# EAGLE design DCshieldV0.42 (EAGLE 6.5.0)
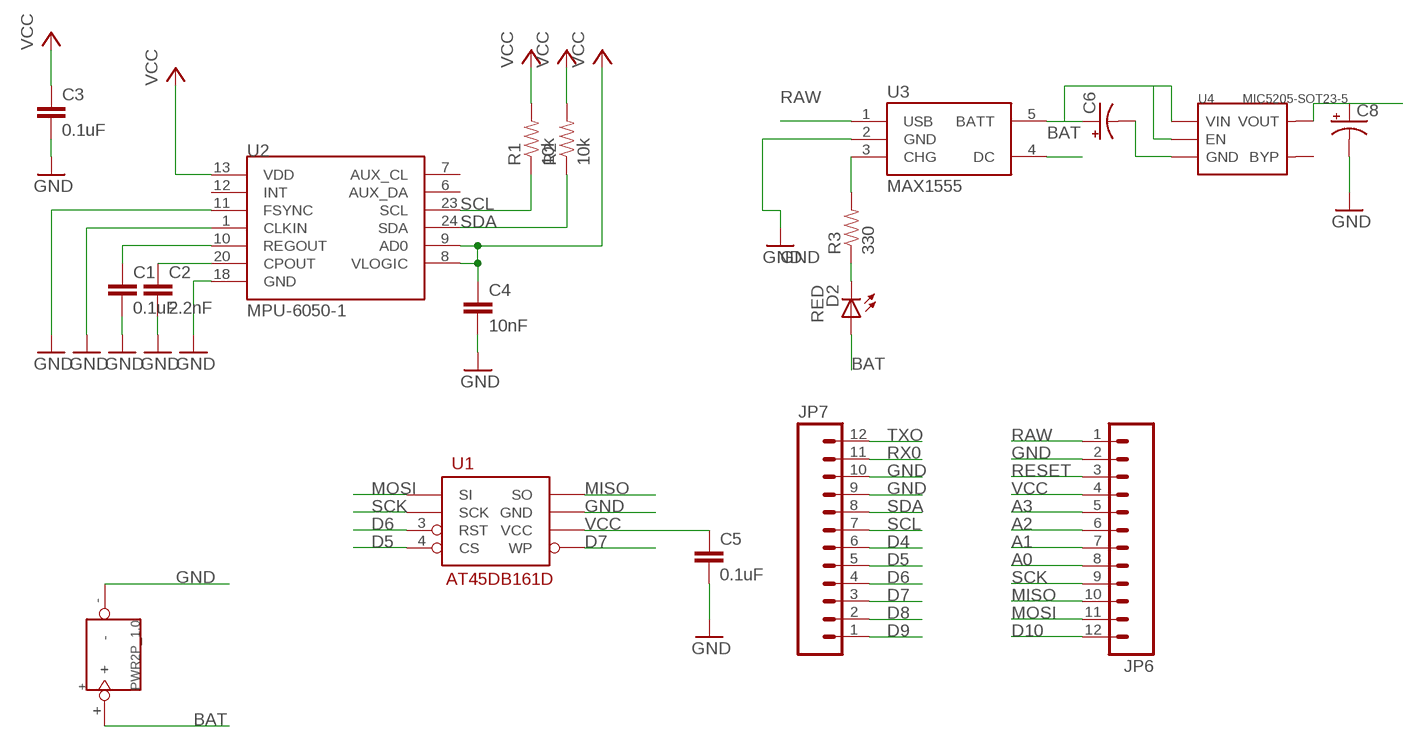
[diagram p0: schematic, sheet 1]

## Parts
+  PWR2P_1.0  [PWR2P_1.0]
C1  0.1uF  CAP0402-CAP  [0402-CAP]
C2  2.2nF  CAP0402-CAP  [0402-CAP]
C3  0.1uF  CAP0402-CAP  [0402-CAP]
C4  10nF  CAP0402-CAP  [0402-CAP]
C5  0.1uF  CAP0402-CAP  [0402-CAP]
C6  CAP_POL1206  [EIA3216]
C8  CAP_POL1206  [EIA3216]
D2  RED  LED-RED0603  [LED-0603]
JP6  M12PTH  [1X12]
JP7  M12PTH  [1X12]
R1  10k  RESISTOR0402-RES  [0402-RES]
R2  10k  RESISTOR0402-RES  [0402-RES]
R3  330  RESISTOR0402-RES  [0402-RES]
U1  AT45DB161D  [SO08-EIAJ]
U2  MPU-6050-1  [QFN-24-4MM2]
U3  MAX1555  [SOT23-5]
U4  MIC5205-SOT23-5  [SOT23-5]

## Nets
A0: JP6.8
A1: JP6.7
A2: JP6.6
A3: JP6.5
BAT [vcc]: +.+ C6.A(+) D2.A U3.5(BATT) U4.1(VIN) U4.3(EN)
D4: JP7.6
D5: JP7.5 U1.4(CS)
D6: JP7.4 U1.3(RST)
D7: JP7.3 U1.5(WP)
D8: JP7.2
D9: JP7.1
D10: JP6.12
GND: +.- C1.2 C2.2 C3.2 C4.2 C5.2 C6.C(-) C8.C(-) JP6.2 JP7.9 JP7.10 U1.7(GND) U2.1(CLKIN) U2.11(FSYNC) U2.18(GND) U3.2(GND) U4.2(GND)
MISO: JP6.10 U1.8(SO)
MOSI: JP6.11 U1.1(SI)
N$15: C1.1 U2.10(REGOUT)
N$16: C2.1 U2.20(CPOUT)
N$18: R3.2 U3.3(CHG)
N$19: D2.C R3.1
RAW [vcc]: JP6.1 U3.1(USB) U3.4(DC)
RESET: JP6.3
RX0: JP7.11
SCK: JP6.9 U1.2(SCK)
SCL: JP7.7 R1.1 U2.23(SCL)
SDA: JP7.8 R2.1 U2.24(SDA)
TXO: JP7.12
VCC: C3.1 C4.1 C5.1 C8.A(+) JP6.4 R1.2 R2.2 U1.6(VCC) U2.8(VLOGIC) U2.9(AD0) U2.13(VDD) U4.5(VOUT)
Unconnected: U2.6(AUX_DA) U2.7(AUX_CL) U2.12(INT) U4.4(BYP)

## Library data of the parts
+ = Seeeduino_Film_v0.9b:PWR2P
C1-C5 = SparkFun-Capacitors:CAP: Capacitor Standard 0603 ceramic capacitor, and 0.1" leaded capacitor.
C6 C8 = SparkFun-Capacitors:CAP_POL: Capacitor Polarized These are standard SMD and PTH capacitors. Normally 10uF, 47uF, and 100uF in electrolytic and tantalum varieties. Always verify the external diameter of the through hole cap, it varies with capacity, voltage, and manufacturer. The EIA devices should be standard.
D2 = SparkFun-LED:LED-RED: Assorted Red LEDs LilyPad 1206- DIO-09912 1206- DIO-00809 0603- DIO-00819; PROD_ID: DIO-00819
JP6 JP7 = SparkFun:M12: Header 12 Standard 12-pin 0.1" header. Use with straight break away headers (SKU : PRT-00116), right angle break away headers (PRT-00553), swiss pins (PRT-00743), machine pins (PRT-00117), and female headers (PRT-00115).
R1-R3 = SparkFun-Resistors:RESISTOR: Resistor Basic schematic elements and footprints for 0603, 1206, and PTH resistors.
U1 = SparkFun-DigitalIC:AT45DB161D: 16-Mbit SPI flash memory
U2 = MPU-6050_Breakout_V11:MPU-6050
U3 = LiPo-USB-Charger-v13:MAX1555: MAX1555 Lithium Charger IC SOT-23 Lithium Polymer charging IC. Schematic element and footprint proven. Spark Fun Electronics SKU : COM-00674
U4 = IC:MIC5205: The MIC5205 is an efficient linear voltage regulator with ultra-low-noise output, very low dropout voltage (typically 17mV at light loads and 165mV at 150mA), and very low ground current (600µA at 100mA output). The MIC5205 offers better than 1% initial accuracy. datasheet here: http://www.micrel.com/product-info/prod/5205.shtml

## Net classes
0 default: width 0.203 mm

## Board
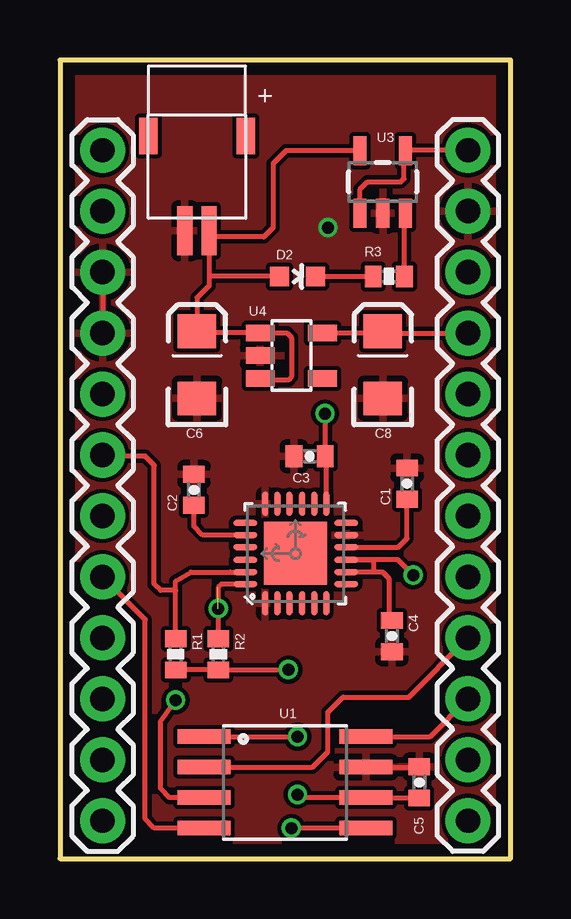
[diagram p1: board, top side]
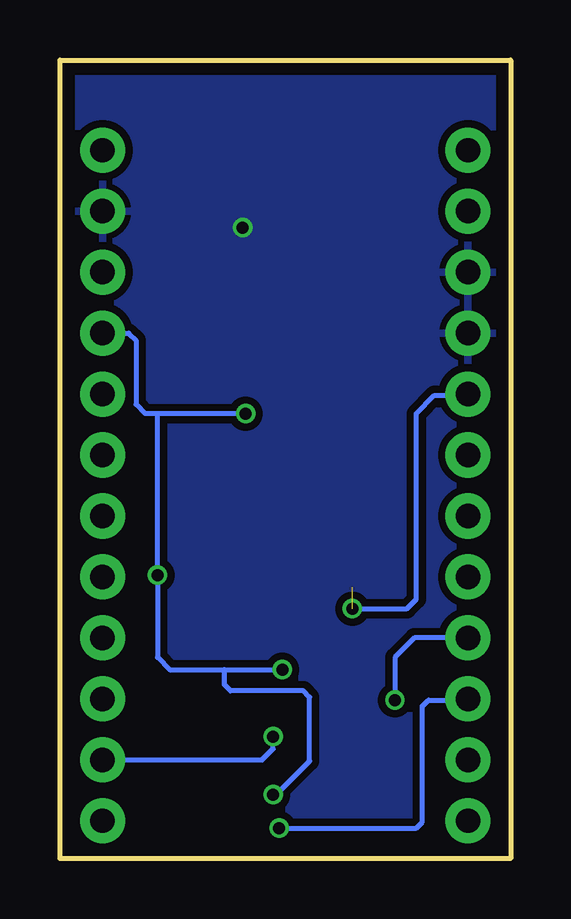
[diagram p2: board, bottom side, seen from below]

Size 18.8 x 33.27 mm. Coordinates in mm from the lower left corner, seen from the top.
Outline: 0,33.27 0,0 18.8,0 18.8,33.27 0,33.27
Copper layers (1*16): Top 0.035mm / dielectric 1.5mm / Bottom 0.035mm
Design rules "EagleRules": minimum track width 7mil, minimum drill 12mil, track to track 7mil, track to pad 7mil, pad to pad 7mil, via to via 7mil, smd to smd 0mil, copper to edge 20mil, drill to drill 10mil, minimum pad ring 10mil, minimum via ring 6mil, stop-mask expansion 2mil, vias tented up to drill 25mil, thermal gap 10mil

### Footprints (pad centres in the part's own frame; a part is rotated, then mirrored left to right if it is on the bottom)
PWR2P_1.0 = smd 2.032 x 0.635: + 0.508,0.508; - 0.508,-0.508 | smd 1.524 x 0.762: P$3 -3.429,2.032; P$4 -3.429,-2.032
0402-CAP = smd 0.7 x 0.9: 1 -0.65,0; 2 0.65,0
EIA3216 = smd 1.4 x 1.6: A 1.4,0; C -1.4,0
LED-0603 = smd 0.8 x 0.8: A 0,-0.75; C 0,0.75
1X12 = drill 1.016 pad 1.88: 1 0,0; 2 2.54,0; 3 5.08,0; 4 7.62,0; 5 10.16,0; 6 12.7,0; 7 15.24,0; 8 17.78,0; 9 20.32,0; 10 22.86,0; 11 25.4,0; 12 27.94,0
0402-RES = smd 0.7 x 0.9: 1 -0.65,0; 2 0.65,0
SO08-EIAJ = smd 0.61 x 2.21: 1 -1.905,-3.378; 2 -0.635,-3.378; 3 0.635,-3.378; 4 1.905,-3.378; 5 1.905,3.353; 6 0.635,3.353; 7 -0.635,3.353; 8 -1.905,3.353
QFN-24-4MM2 = smd 1.016 x 0.254: 1 -2.066,1.257; 2 -2.066,0.75; 3 -2.066,0.247; 4 -2.066,-0.287; 5 -2.066,-0.792; 6 -2.066,-1.297; 13 2.086,-1.297; 14 2.086,-0.792; 15 2.086,-0.287; 16 2.086,0.247; 17 2.086,0.75; 18 2.086,1.257 | smd 0.254 x 1.016: 7 -1.267,-2.122; 8 -0.762,-2.122; 9 -0.258,-2.122; 10 0.278,-2.122; 11 0.78,-2.122; 12 1.287,-2.122; 19 1.287,2.082; 20 0.78,2.082; 21 0.278,2.082; 22 -0.258,2.082; 23 -0.762,2.082; 24 -1.267,2.082 | smd 2.616 x 2.616: P$1 0.02,-0.01
SOT23-5 = smd 0.55 x 1.2: 1 -0.95,-1.3; 2 0,-1.3; 3 0.95,-1.3; 4 0.95,1.3; 5 -0.95,1.3
SOT23-5' = smd 0.69 x 1.2: 1 -0.95,-1.3; 2 0,-1.3; 3 0.95,-1.3; 4 0.95,1.3; 5 -0.95,1.3

### Placement (x,y rotation side)
+  5.71,26.67 270 top
C1  14.48,15.62 90 top
C2  5.59,15.37 90 top
C3  10.41,16.76 180 top
C4  13.84,9.27 270 top
C5  14.99,3.17 90 top
C6  5.71,20.57 90 top
C8  13.46,20.57 90 top
D2  9.91,24.26 270 top
JP6  17.02,29.51 270 top
JP7  1.78,1.57 90 top
R1  4.83,8.51 270 top
R2  6.6,8.51 270 top
R3  13.72,24.26 0 top
U1  9.4,3.17 270 top
U2  9.81,12.7 90 top
U3  13.46,28.19 0 top
U4  MIC5205-SOT23-5  [SOT23-5']  9.65,20.95 270 top

### Tracks (layer width: path | path; a pad name or v marks a point on that pad's centre or on a via)
BAT
  Top 0.203: 6.35,26.29 +.+ | C6.A 6.22,22.23 | U3.5 9.43,29.49 8.89,28.96 8.89,26.29 8.51,25.91 6.48,25.91 +.+ | U4.3 8.42,19.94 9.53,19.94 9.65,20.07 9.65,21.72 9.46,21.91 U4.1 6.04,21.91 C6.A | +.+ 6.22,24.26 | 6.22,24.26 6.22,23.88 5.71,23.37 C6.A | D2.A 6.22,24.26
D5
  Top 0.203: U1.4 3.94,1.27 3.56,1.65 3.56,9.96 JP7.5
D6  (via drill 0.5)
  Top 0.203: U1.3 4.57,2.54 4.19,2.92 4.19,5.71 v4.83,6.6
  Bottom 0.203: JP7.4 4.01,9.2 4.83,8.38 v4.83,6.6
D7  (via drill 0.5)
  Top 0.203: U1.5 v9.65,1.27
  Bottom 0.203: v9.65,1.27 3.94,1.27 3.68,1.52 3.68,6.35 3.43,6.6 1.83,6.6 JP7.3
GND  (via drill 0.5)
  Top 0.203: JP7.10 JP7.9 | U1.7 14.97,3.81 C5.2
  other vias: 11.18,26.29
  pour Top: -0.1,33.35 0.46,0.25 18.34,0.25 18.8,33.4
  pour Bottom (isolate 0.305): -0.05,33.35 0.46,0.25 18.34,0.25 18.8,33.38
MISO
  Top 0.203: U1.8 15.44,5.08 JP6.10
MOSI  (via drill 0.5)
  Top 0.203: U1.1 v9.91,5.08
  Bottom 0.203: JP6.11 10.36,4.12 9.91,4.57 v9.91,5.08
N$15
  Top 0.203: U2.10 14.12,12.98 14.48,13.34 C1.1
N$16
  Top 0.203: U2.20 5.95,13.48 5.59,13.84 C2.1
N$18
  Top 0.203: R3.2 14.37,26.85 U3.3
N$19
  Top 0.203: D2.C R3.1
RAW
  Top 0.203: JP6.1 14.41,29.52 U3.4 14.35,29.43 14.35,28.32 14.22,28.19 12.83,28.19 12.51,27.88 U3.1
SCK
  Top 0.203: U1.2 10.54,3.81 11.18,4.45 11.18,6.1 11.81,6.73 14.55,6.73 JP6.9
SCL
  Top 0.203: R1.1 4.83,11.18 | 4.83,11.18 4.83,11.56 5.46,11.94 7.1,11.94 U2.23 | 4.83,11.18 4.19,11.18 3.94,11.43 3.94,16.38 3.56,16.76 1.83,16.76 JP7.7
SDA  (via drill 0.5)  (1 unrouted)
  Top 0.203: U2.24 6.73,11.43 6.6,11.3 R2.1
  Bottom 0.203: v6.6,10.41 4.32,10.41 3.94,10.79 3.94,18.54 3.17,19.3 1.83,19.3 JP7.8
VCC  (via drill 0.5)
  Top 0.203: R1.2 R2.2 9.51,7.86 v9.53,7.87 | C5.1 14.97,2.54 U1.6 10.03,2.54 v9.91,2.67 | v11.05,18.54 11.06,17.77 C3.1 arc-90 11.11,16.97 U2.13 | C4.1 13.72,10.05 13.72,11.68 13.46,11.94 13.08,11.94 | 13.08,11.94 U2.8 | v14.73,11.81 14.1,12.44 U2.9 13.08,12.44 13.08,11.94 | JP6.4 13.72,21.9 C8.A 13.52,21.91 U4.5
  Bottom 0.203: v11.05,18.54 14.73,18.54 | 14.73,18.54 15.24,18.54 15.62,18.92 15.62,21.59 15.93,21.9 JP6.4 | v9.91,2.67 9.78,2.67 8.38,4.06 8.38,6.73 8.64,6.98 11.68,6.98 11.94,7.24 11.94,7.87 | 11.94,7.87 14.22,7.87 14.73,8.38 v14.73,11.81 14.73,18.54 | 11.94,7.87 v9.53,7.87